# Altium schematic sheet MPU 9250.SchDoc
size A4
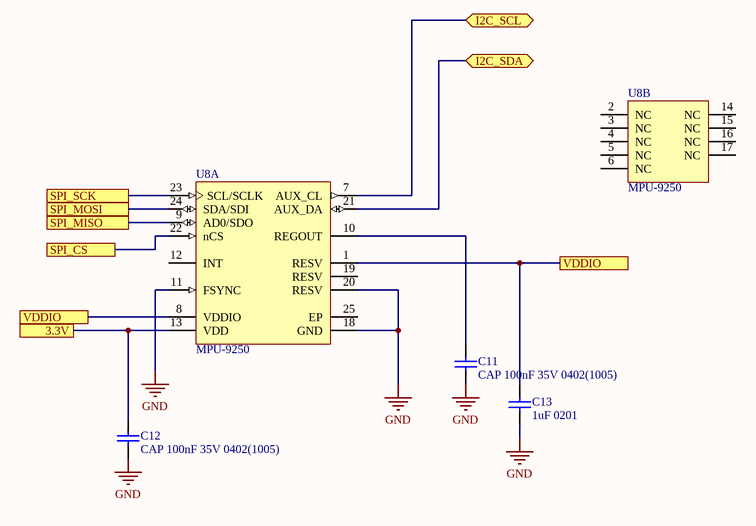
[diagram p0: MPU 9250.SchDoc]

## Parts
C11  CAP 100nF 35V 0402(1005)  [CAPC0402(1005)60_N]
C12  CAP 100nF 35V 0402(1005)  [CAPC0402(1005)60_N]
C13  1uF 0201  [CAPC0603X33X15LL03T05]
U8  MPU-9250  [INSE-QFN-24-1700X1540TP_L]  (parts A,B of 2)

## Ports
3.3V, I2C_SCL (bidir), I2C_SDA (bidir), SPI_CS, SPI_MISO, SPI_MOSI, SPI_SCK, VDDIO

## Nets
GND: C11.1 C12.1 C13.1 U8.11(FSYNC) U8.18(GND) U8.20(RESV)
3.3V: C12.2 U8.13(VDD) ; port 3.3V
I2C_SCL: U8.7(AUX_CL) ; port I2C_SCL
I2C_SDA: U8.21(AUX_DA) ; port I2C_SDA
SPI_CS: U8.22(nCS) ; port SPI_CS
SPI_MISO: U8.9(AD0/SDO) ; port SPI_MISO
SPI_MOSI: U8.24(SDA/SDI) ; port SPI_MOSI
SPI_SCK: U8.23(SCL/SCLK) ; port SPI_SCK
VDDIO: C13.2 U8.1(RESV) U8.8(VDDIO) ; port VDDIO
NetC11_2: C11.2 U8.10(REGOUT)

Not connected (* = marked no-connect by the designer): U8 2(NC) 3(NC) 4(NC) 5(NC) 6(NC) 12(INT) 14(NC) 15(NC) 16(NC) 17(NC) 19(RESV) 25(EP)

## Library data of the parts
C11 C12 = CMP-1034-02076-1: CAP 100nF 35V ±20% 0402 (1005 Metric) Thickness 0.6mm SMD                                                  963-GMK105BJ104MV-F; Case-Metric: 1005; Tolerance: Â±20%; Case-EIA: 0402; Rated Voltage: 35 V; Max Thickness: 0.6 mm; Value: 100nF; Technology: SMT
C13 = CMP-2010-00405-1: GRM033R60J105ME11D; Dimensios: 0201; Voltage: 6.3V; Part Number: GRM033R60J105ME11D; capacitnce: 1uF; Datasheet: https://br.mouser.com/datasheet/2/281/murata_03052018_GRM_Series_1-1310166.pdf
U8 = CMP-2100-03657-1: 9-axis MotionTracking device, 2.4 to 3,6 V, -40 to 85 degC, 24-Pin QFN, RoHS, Tape and Reel; Manufacturer: InvenSense; Max Supply Voltage: 3.6V; Min Supply Voltage: 2.4V; Package Reference: QFN-24; Package Quantity: 1; Datasheet Version: Rev. 1.0, 01/2014; Case/Package: QFN; Package Description: 24-Pin Quad Flat No-lead Package, Body 3 x 3 mm, Pitch 0.4 mm; Datasheet URL: http://datasheet.octopart.com/MPU-9250-InvenSense-datasheet-21859386.pdf; RoHSCompliant: true; Max Operating Temperature: 85degC; Height: 1mm; Mount: SurfaceMount; Manufacturer URL: http://www.invensense.com/; Width: 3.1mm; Min Operating Temperature: -40degC; Length: 3.1mm